# Altium schematic sheet Boost Converter.SchDoc
size A; SheetNumber: 2; SheetTotal: 2
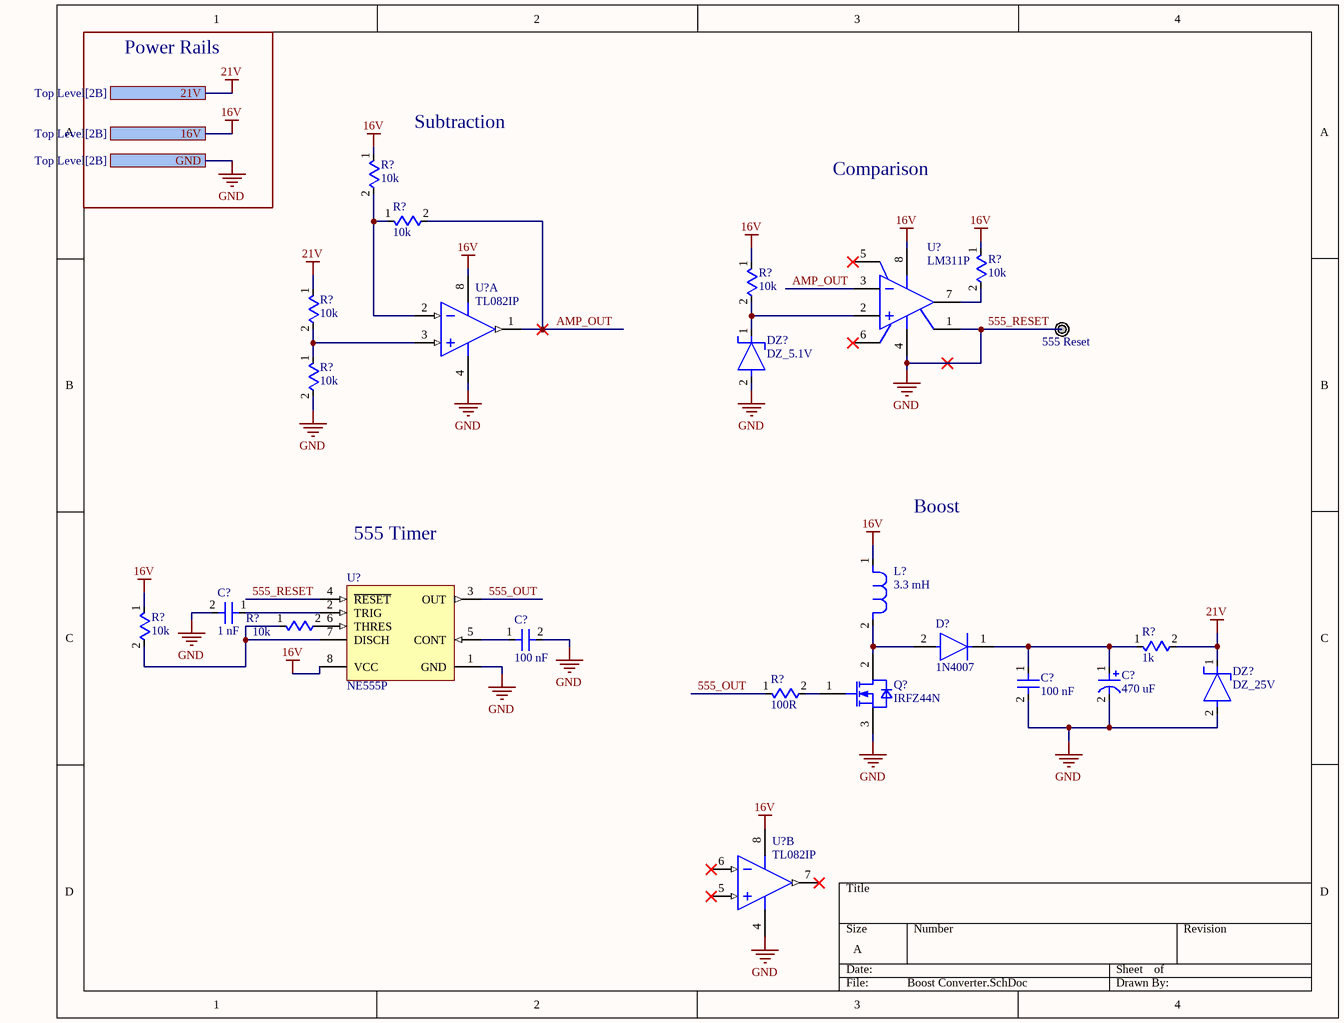
[diagram p0: Boost Converter.SchDoc]

## Parts
(Parts that share a designator on the sheet are numbered #1, #2 ... from top to bottom, then left to right.)
C?#1  1 nF  [Generic small capacitor]
C?#2  100 nF  [Generic small capacitor]
C?#3  100 nF  [Generic small capacitor]
C?#4  470 uF  [electrolytic cap]
D?  1N4007  [FP-1N4007-MFG]
DZ?#1  DZ_5.1V
DZ?#2  DZ_25V
L?  3.3 mH
Q?  IRFZ44N  [IFX-PG-TO220-3-904-1]
R?#1  10k  [Axial 0.5]
R?#2  10k  [Axial 0.5]
R?#3  10k  [Axial 0.5]
R?#4  10k  [Axial 0.5]
R?#5  10k  [Axial 0.5]
R?#6  10k  [Axial 0.5]
R?#7  10k  [Axial 0.5]
R?#8  10k  [Axial 0.5]
R?#9  1k  [Axial 0.5]
R?#10  100R  [Axial 0.5]
TP?  555 Reset  [TESTPOINT]  (no BOM)
U?#1  LM311P  [FP-P0008A-MFG]
U?#2  TL082IP  [P0008A]  (part A of 2)
U?#3  NE555P  [P0008A]
U?#4  TL082IP  [P0008A]  (part B of 2)

## Ports
16V (see Top Level[2B]), 21V (see Top Level[2B]), GND (see Top Level[2B])

## Nets
16V: L?.1 R?#1.1 R?#3.1 R?#4.1 R?#7.1 U?#1.8(VCC+) U?#2.8(VCC+) U?#3.8(VCC) U?#4.8(VCC+) ; port 16V
21V: DZ?#2.1 R?#5.1 R?#9.2 ; port 21V
555_RESET: C?#1.2 C?#2.2 C?#3.2 C?#4.2 DZ?#1.2 DZ?#2.2 Q?.3(SOURCE) R?#6.2 TP?.1(TP) U?#1.1(EMIT_OUT) U?#1.4(VCC-) U?#2.4(VCC-) U?#3.1(GND) U?#3.4(~{RESET}) U?#4.4(VCC-) ; port GND  [also labelled GND]
555_OUT: R?#10.1 U?#3.3(OUT)
AMP_OUT: R?#2.2 U?#1.3(IN-) U?#2.1(OUT1)
NetC?#1_1: C?#1.1 U?#3.2(TRIG)
NetC?#2_1: C?#2.1 U?#3.5(CONT)
NetC?#3_1: C?#3.1 C?#4.1 D?.1(C) R?#9.1
NetD?_2: D?.2(A) L?.2 Q?.2(DRAIN)
NetDZ?#1_1: DZ?#1.1 R?#4.2 U?#1.2(IN+)
NetQ?_1: Q?.1(GATE) R?#10.2
NetR?#1_2: R?#1.2 R?#2.1 U?#2.2(IN1-)
NetR?#3_2: R?#3.2 U?#1.7(COL_OUT)
NetR?#5_2: R?#5.2 R?#6.1 U?#2.3(IN1+)
NetR?#7_2: R?#7.2 R?#8.1 U?#3.7(DISCH)
NetR?#8_2: R?#8.2 U?#3.6(THRES)

Not connected (* = marked no-connect by the designer): U?#1 5(BALANCE)* 6(BAL/STRB)*; U?#4 5(IN2+)* 6(IN2-)* 7(OUT2)*

## Notes on the sheet
- Power Rails
- (near R?#1) Subtraction
- Comparison
- 555 Timer
- Boost

## Library data of the parts
C?#1-C?#3 = CAP_GENERIC
C?#4 = electrolytic cap
D? = CMP-123542-000001-1: Rectifier diode 1000 V 1 A DO-41, ,; Manufacturer: Diotec; Max Surge Forward Current: 27A; Forward Current: 1A; Max Junction Temp: +175°C; Reverse Voltage: 1000V; Value: 15pF; Peak Reverse Current: 5uA; Category: Diode; Temperature Range Low: -50°C; Automotive: No; Temperature: -50°C to +175°C; Lead Free: Yes; ComponentLink2Description: Datasheet; Max Repetitive Reverse Voltage: 1000V; ComponentLink2URL: https://datasheet.octopart.com/1N4007-Diotec-datasheet-62346875.pdf; Manufacturer Part Number: 1N4007; Device Class L3: Rectifier Diodes; Height: 2.8mm; Octopart: https://octopart.com/1n4007-diotec-4040411; Package: 1N4007; Temperature Range High: +175°C; Device Class L1: Discrete Semiconductors; Device Class L2: Diodes; RoHS: TRUE; Capacitance: 15pF; Ipc Land Pattern Name: DIOAD888W100L520D280
DZ?#2 = Zener Diode
L? = Inductor 3.3mH
Q? = IRFZ44N: OptiMOS 3 Power-Transistor, VDS 100V; Manufacturer: Infineon Technologies; Manufacturer Order Number: IRFZ44N; PackageReference: PG-TO220-3-904
R?#1-R?#10 = RES_GENERIC
TP? = CMP-020-0000-4: Source: UBC Formula Electric.SchLib; Design Item ID: Thru-Hole Test Point
U?#1 = CMP-1685-00016-2: Manufacturer Lifecycle Status: ACTIVE; NexarPartId: 24336; Output Type: TTL; Max Output Voltage: 7.5mV; Min Supply Voltage: 3.5V; Min Dual Supply Voltage: 1.75V; Max Supply Current: 7.5mA; Number of Elements: 1; Response Time: 165ns; Max Dual Supply Voltage: 15V; Max Supply Voltage: 30V; Max Junction Temperature (Tj): 150°C; Max Power Dissipation: 500mW; Input Offset Voltage (Vos): 2mV; Resistance: 390Ω; Operating Supply Voltage: 28V; Power Rating: 100mW; Dual Supply Voltage: 9V; Output Current per Channel: 50mA; Turn-On Delay Time: 115ns; Tolerance: 1%; Voltage Gain: 106.02dB; Input Bias Current: 250nA; Voltage Rating: 75V; Contact Plating: Gold; Case Code (Imperial): 0603; Number of Circuits: 1; Lifecycle Status: Production; Ambient Temperature Range High: 70°C; Radiation Hardening: No; Quiescent Current: 7.5mA; Number of Channels: 1; Max Operating Temperature: 70°C; Height: 5.08mm; Type: General Purpose; Case Code (Metric): 1608; Mount: Surface Mount, Through Hole; Case/Package: PDIP; Thickness: 3.9mm; REACH SVHC: No SVHC; Length: 9.81mm; RoHS: Compliant; Schedule B: 8542390000, 8542390000; Lead Free: Lead Free; Min Operating Temperature: 0°C; Width: 6.35mm; Output Current: 50mA; Packaging: Tape and Reel; Nominal Supply Current: 7.5mA; Weight: 2.012816mg; Propagation Delay: 115ns; Max Input Current: 250nA; Number of Pins: 8
U?#2 U?#4 = CMP-0017-01015-2: JFET-Input Operational Amplifier, 7 to 36 V, -40 to 85 degC, 8-pin DIP (P8), Pb-Free (RoHS); Manufacturer: Texas Instruments; Total Supply Voltage(Max)(+5V is 5, +/-5V is 10): 36; Number of Channels: 2; GBW(Typ)(MHz): 3; Vio (25C)(Max)(mV): 6; Offset Drift(Typ)(uV/C): 18; Slew Rate(Typ)(V/us): 13; Total Supply Voltage(Min)(+5V is 5, +/-5V is 10): 7; CMRR(Min)(dB): 75; Iq per channel(Max)(mA): 2.8; IIB(Max)(pA): 200; Sub Family: General Purpose Amplifier, High Supply Voltage Amplifier (>=30V); Rating: Catalog; ComponentLink1Description: Manufacturer URL; Code_JEDEC: MS-001; Eco-Plan: Pb-Free (RoHS); ComponentLink2Description: Datasheet; PackageReference: P0008A; ComponentLink3Description: Package Specification; ComponentLink1URL: http://www.ti.com/; PackageDescription: 8-Pin Plastic In-Line, Body 9.59 x 6.35 mm, Pitch 2.54 mm; Vn at 1kHz(Typ)(nV/rtHz): 18; PackageVersion: 4040082/E, 04/2010; ComponentLink3URL: http://www.ti.com/litv/pdf/mpdi001b; DatasheetVersion: SLOS081G; PartNumber: TL082IP; Mounting Technology: Through Hole; ComponentLink2URL: http://www.ti.com/lit/ds/symlink/tl082.pdf
U?#3 = CMP-2000-04954-1: Precision Timer, 4.5 to 16 V, 0 to 70 degC, 8-Pin DIP, Pb-Free, Tube; Manufacturer: TexasInstruments; Maximum High Level Output Current: -200mA; Number of Internal Timers: 1; Operating Supply Voltage: 5; Maximum Low Level Output Current: 200mA; Rad Hard: No; Packaging: Rail/Tube; Manufacturer URL: http://www.ti.com/; Package Reference: P8; Package Description: 8-Pin Double In-line Package, Body 9.59 x 6.35 mm, Pitch 2.54 mm; Package URL: http://www.ti.com/lit/ml/mpdi001b/mpdi001b.pdf; Type: Standard; Datasheet URL: http://www.ti.com/general/docs/lit/getliterature.tsp?genericPartNumber=NE555&fileType=pdf; Category: Timer; Package: 8PDIP; Datasheet Version: Rev. I, 09/2014